# Altium schematic sheet SH.SchDoc
size A4
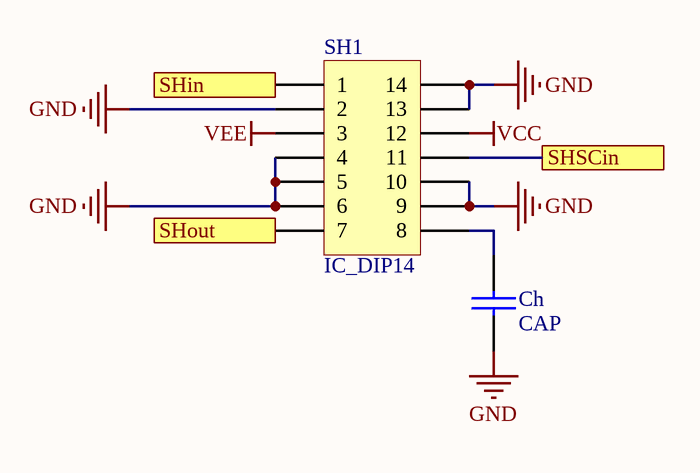
[diagram p0: SH.SchDoc]

## Parts
Ch  CAP  [1206]
SH1  IC_DIP14  [D014_M]

## Ports
SHin, SHout, SHSCin

## Nets
GND: Ch.2 SH1.2 SH1.4 SH1.5 SH1.6 SH1.9 SH1.10 SH1.13 SH1.14
VCC: SH1.12
VEE: SH1.3
SHin: SH1.1 ; port SHin
SHout: SH1.7 ; port SHout
SHSCin: SH1.11 ; port SHSCin
NetCh_1: Ch.1 SH1.8